# EAGLE design sendai_pcba (EAGLE 9.4.2)
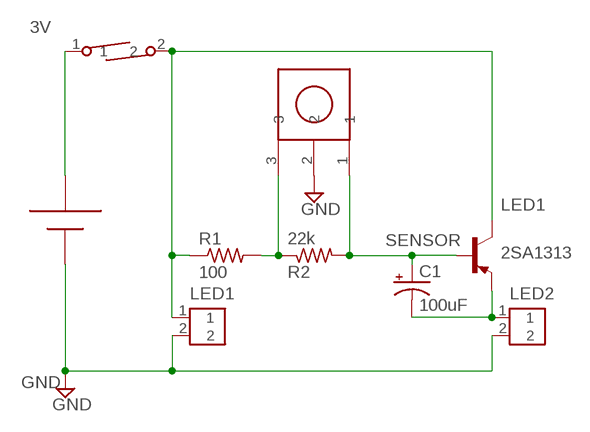
[diagram p0: schematic, sheet 1]

## Parts
C1  100uF  CPOL-USTT2D6  [TT2D6]
R1  100  R-US_R0603  [R0603]
R2  22k  R-US_R0603  [R0603]
T1  2SA1313  -PNP-SOT23-BEC  [SOT23-BEC]
U$1  CR2032_VCR2032_V  [CR2032_V]
U$2  CONNECTER_CON2  [CONNECTER_CON2]
U$3  CONNECTER_CON2  [CONNECTER_CON2]
U$4  LEAD_SWITCH_LEAD_SWITCH  [LEAD_SWITCH_LEAD_SWITCH]
U$5  OSRB38C9AA  [OSRB38C9AA]

## Nets
3V: U$1.3(+) U$4.1
GND: U$1.2(-) U$2.2 U$3.2 U$5.2
LED1: R1.1 T1.C U$2.1 U$4.2
LED2: C1.- T1.E U$3.1
SENSOR: C1.+ R2.2 T1.B U$5.1
V: R1.2 R2.1 U$5.3

## Library data of the parts
C1 = MATHRAX-a:CPOL-US: POLARIZED CAPACITOR, American symbol
R1 R2 = MATHRAX-a:R-US_: RESISTOR, American symbol
T1 = DC_LOAD_AU:*-PNP-: PNP Transistror
U$1 = sendai:CR2032_V
U$2 U$3 = sendai:CONNECTER_CON2
U$4 = sendai:LEAD_SWITCH_LEAD_SWITCH
U$5 = sendai:OSRB38C9AA: Infrared Receiver Module OSRB38C9AA <http://akizukidenshi.com/catalog/g/gI-04659/> (株)秋月電子通商 赤外線リモコン受信モジュールＯＳＲＢ３８Ｃ９ＡＡ（２個入）

## Board
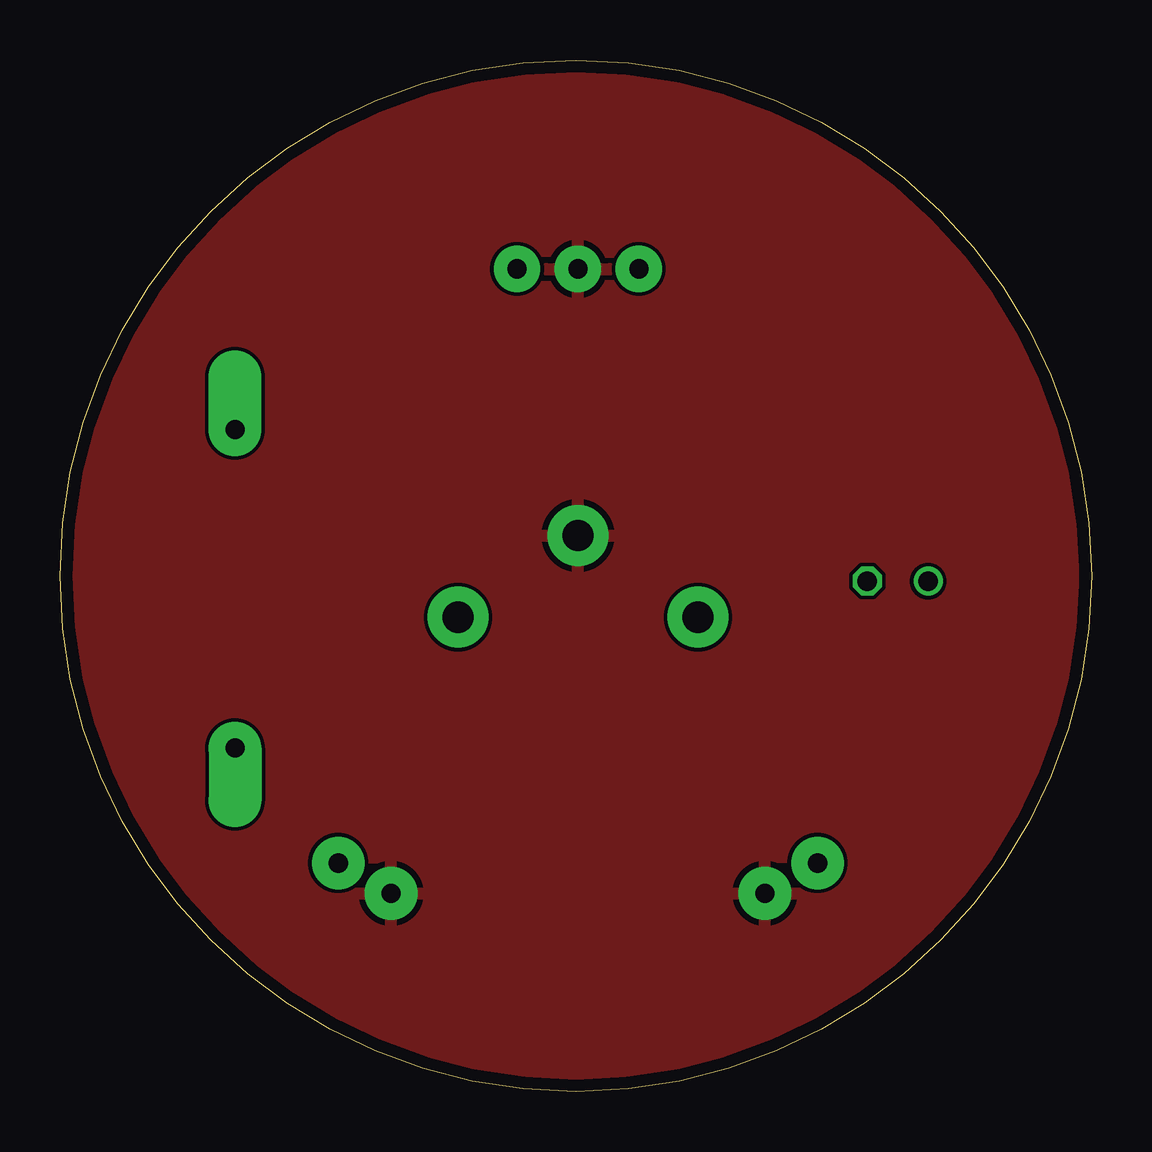
[diagram p1: board, top side]
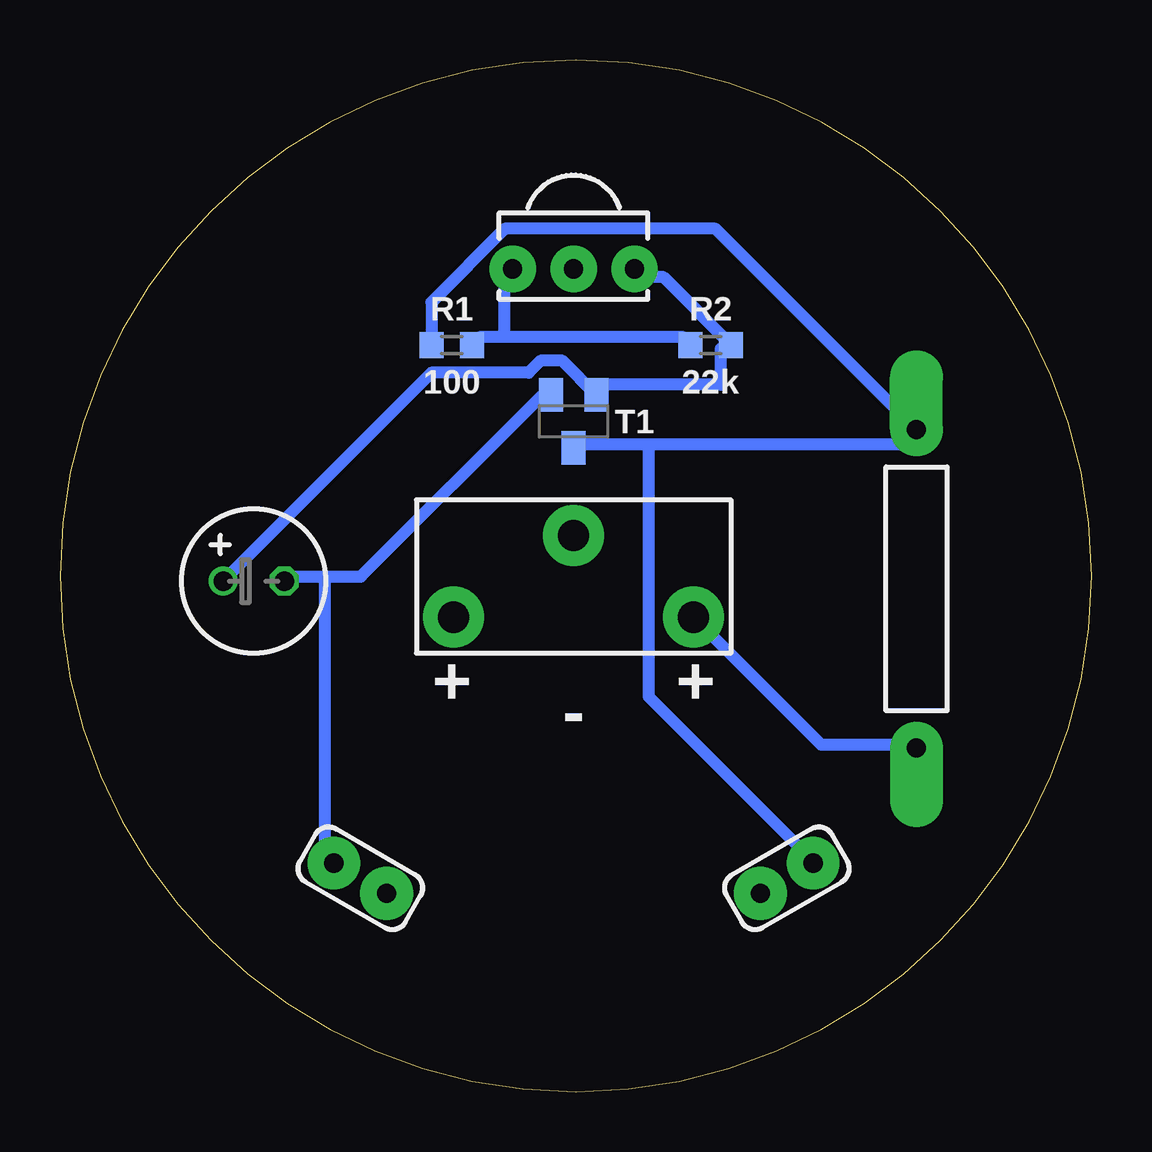
[diagram p2: board, bottom side, seen from below]

Size 43 x 43 mm. Coordinates in mm from the lower left corner, seen from the top.
Outline: 43,21.5 42.89,19.3 42.56,17.17 42.03,15.11 41.31,13.13 40.41,11.25 39.33,9.48 38.09,7.82 36.7,6.3 35.18,4.91 33.52,3.67 31.75,2.59 29.87,1.69 27.89,0.97 25.83,0.44 23.7,0.11 21.5,0 19.3,0.11 17.17,0.44 15.11,0.97 13.13,1.69 11.25,2.59 9.48,3.67 7.82,4.91 6.3,6.3 4.91,7.82 3.67,9.48 2.59,11.25 1.69,13.13 0.97,15.11 0.44,17.17 0.11,19.3 0,21.5 0.11,23.7 0.44,25.83 0.97,27.89 1.69,29.87 2.59,31.75 3.67,33.52 4.91,35.18 6.3,36.7 7.82,38.09 9.48,39.33 11.25,40.41 13.13,41.31 15.11,42.03 17.17,42.56 19.3,42.89 21.5,43 23.7,42.89 25.83,42.56 27.89,42.03 29.87,41.31 31.75,40.41 33.52,39.33 35.18,38.09 36.7,36.7 38.09,35.18 39.33,33.52 40.41,31.75 41.31,29.87 42.03,27.89 42.56,25.83 42.89,23.7 43,21.5
Copper layers (1*16): Top 0.035mm / dielectric 1.6mm / Bottom 0.035mm
Design rules "PCBGOGO_2-layer_PCB_eagle_rule *": minimum track width 0.5mm, minimum drill 0.35mm, track to track 6mil, track to pad 6mil, pad to pad 6mil, via to via 8mil, smd to smd 0mil, copper to edge 20mil, drill to drill 10mil, minimum pad ring 6mil, minimum via ring 6mil, stop-mask expansion 0mil, vias tented up to drill 100mil, thermal gap 10mil

### Footprints (pad centres in the part's own frame; a part is rotated, then mirrored left to right if it is on the bottom)
TT2D6 = drill 0.813: + -1.27,0 | drill 0.813 octagon: - 1.27,0
R0603 = smd 1 x 1.1: 1 -0.85,0; 2 0.85,0
SOT23-BEC = smd 1 x 1.4: B -0.95,-1.1; C 0,1.1; E 0.95,-1.1
CR2032_V = drill 1.3 pad 2.54: 1 -5,-1.495; 2 0,1.905; 3 5,-1.495
CONNECTER_CON2 = drill 0.8 pad 2.2: 1 -1.27,0; 2 1.27,0
LEAD_SWITCH_LEAD_SWITCH = drill 0.8 pad 2.2 offset: 1 -6.635,0; 2 6.635,0
OSRB38C9AA = drill 0.8 pad 1.93: 1 -2.54,0; 2 0,0; 3 2.54,0

### Placement (x,y rotation side)
C1  34.93,21.28 0 bottom
R1  26.67,31.12 0 bottom
R2  15.88,31.12 0 bottom
T1  21.59,27.94 180 bottom
U$1  21.59,21.27 0 bottom
U$2  12.7,8.89 210 bottom
U$3  30.48,8.89 330 bottom
U$4  7.3,20.96 90 bottom
U$5  21.59,34.29 180 bottom

### Tracks (layer width: path | path; a pad name or v marks a point on that pad's centre or on a via)
3V
  Bottom 0.5: U$4.1 7.44,14.46 11.28,14.46 U$1.3
GND
  pour Top: 0,43.81 43.81,43.81 43.81,0 -0.64,0
LED1
  Bottom 0.5: 18.46,26.96 21.46,26.96 T1.C | 18.46,26.96 18.46,16.46 11.96,9.96 U$2.1 | 18.46,26.96 7.93,26.96 U$4.2 15.67,35.96 24.46,35.96 27.52,32.9 R1.1
LED2
  Bottom 0.5: 31.96,21.46 33.46,21.46 C1.- | 31.96,21.46 30.46,21.46 22.88,29.04 T1.E | 31.96,21.46 31.96,9.91 U$3.1
SENSOR
  Bottom 0.5: C1.+ 27.51,29.96 23.46,29.96 22.96,30.46 22.06,30.46 T1.B 20.46,29.46 15.46,29.46 15.46,30.96 R2.2 17.87,33.96 18.72,33.96 U$5.1
V
  Bottom 0.5: 24.46,31.46 25.46,31.46 R1.2 | 24.46,31.46 24.46,33.96 U$5.3 | 24.46,31.46 17.07,31.46 R2.1

### Text on the board
bNames: + | + | -